# Altium schematic sheet Sheet1.SchDoc
size A4; Author: Jose Luis Llorente González; CompanyName: ETSIT; Organization: UPM; Revision: V1.0
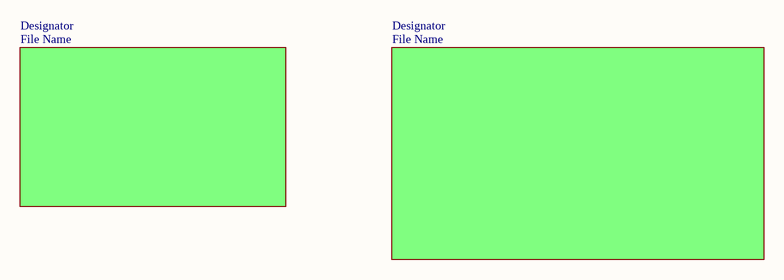
[diagram p0: Sheet1.SchDoc]

## Sub-sheets
Designator = File Name: no entries
Designator = File Name: no entries